# Altium schematic sheet 8051红外遥控控制电路.SCHDOC
size A4
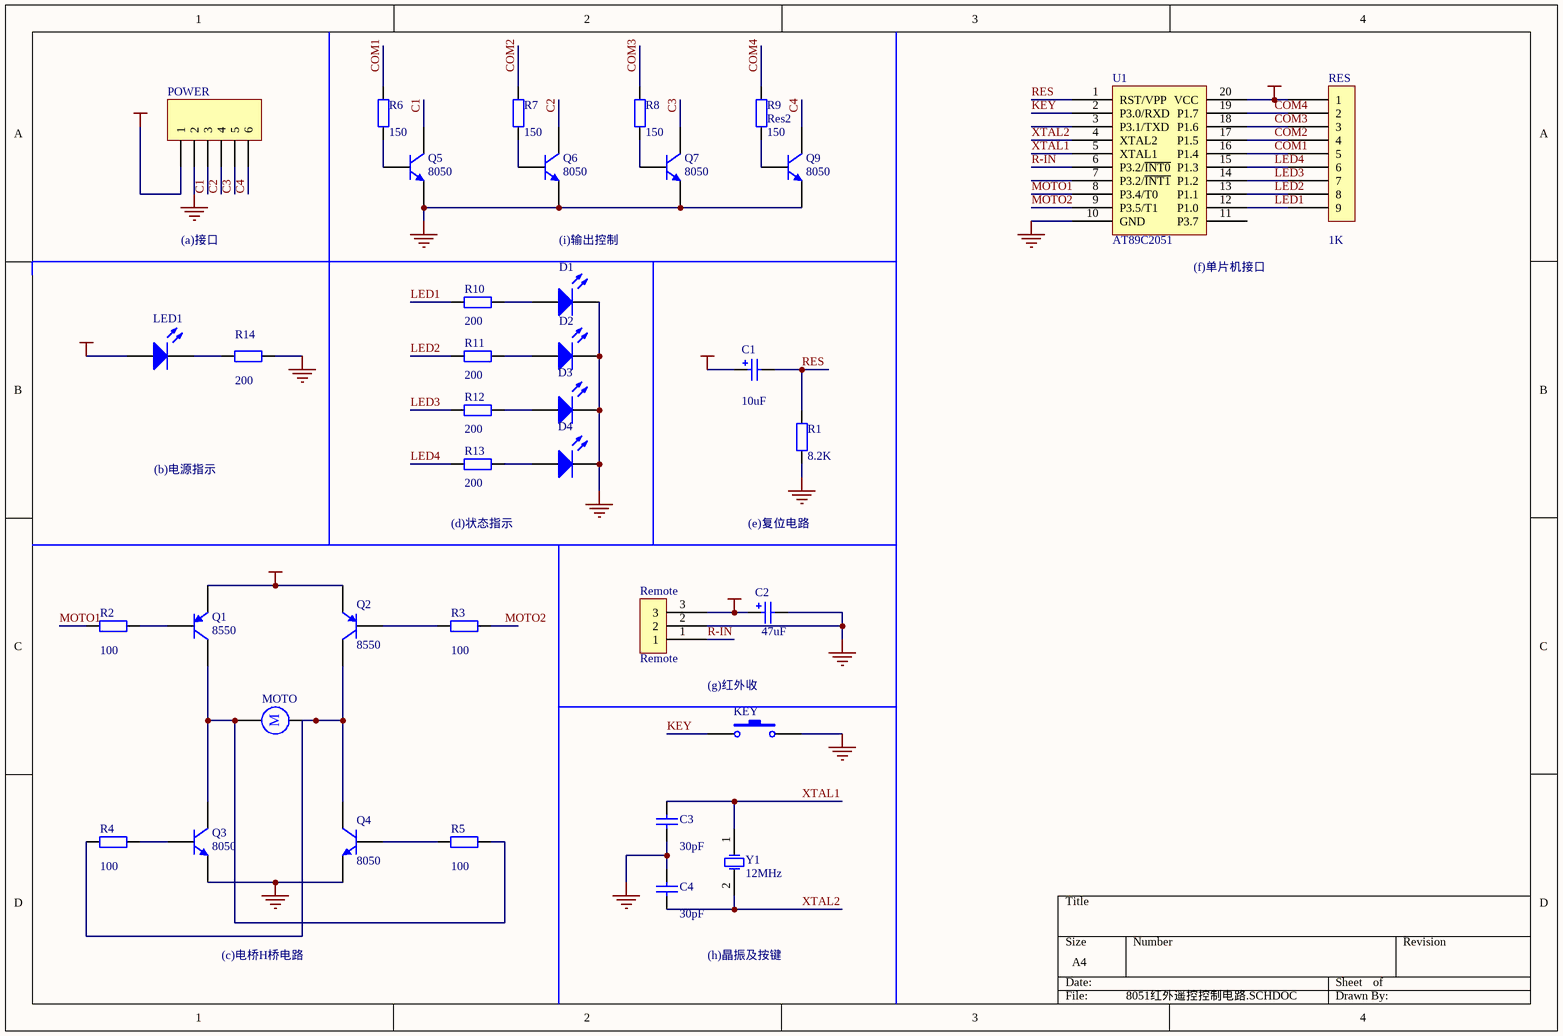
[diagram p0: 8051红外遥控控制电路.SCHDOC]

## Parts
C1  value 10uF  [RB.1/.2]  (hidden comment: Cap Pol2)
C2  value 47uF  [RB.1/.2]  (hidden comment: Cap Pol2)
C3  value 30pF  [RAD-0.1]  (hidden comment: Cap)
C4  value 30pF  [RAD-0.1]  (hidden comment: Cap)
D1  LED2  [LED5]  (value not drawn)
D2  LED2  [LED5]  (value not drawn)
D3  LED2  [LED5]  (value not drawn)
D4  LED2  [LED5]  (value not drawn)
KEY  SW-PB  [SW_PB]  (value not drawn)
LED1  LED0  [LED5]  (value not drawn)
MOTO  Motor  [AXIAL-0.3]  (value not drawn)
POWER  Header 6  [HDR1X6]  (value not drawn)
Q1  8550  [SO-G3/C2.5]
Q2  8550  [SO-G3/C2.5]
Q3  8050  [BCY-W3]
Q4  8050  [BCY-W3]
Q5  8050  [BCY-W3/E4]
Q6  8050  [BCY-W3/E4]
Q7  8050  [BCY-W3/E4]
Q9  8050  [BCY-W3/E4]
R1  value 8.2K  [AXIAL-0.4]  (hidden comment: Res2)
R2  value 100  [AXIAL-0.4]  (hidden comment: Res2)
R3  value 100  [AXIAL-0.4]  (hidden comment: Res2)
R4  value 100  [AXIAL-0.4]  (hidden comment: Res2)
R5  value 100  [AXIAL-0.4]  (hidden comment: Res2)
R6  value 150  [AXIAL-0.4]  (hidden comment: Res2)
R7  value 150  [AXIAL-0.4]  (hidden comment: Res2)
R8  value 150  [AXIAL-0.4]  (hidden comment: Res2)
R9  Res2  value 150  [AXIAL-0.4]
R10  value 200  [AXIAL-0.4]  (hidden comment: Res2)
R11  value 200  [AXIAL-0.4]  (hidden comment: Res2)
R12  value 200  [AXIAL-0.4]  (hidden comment: Res2)
R13  value 200  [AXIAL-0.4]  (hidden comment: Res2)
R14  value 200  [AXIAL-0.4]  (hidden comment: Res2)
Remote  Remote  [REM]
RES  value 1K  [SIP9]  (hidden comment: RES)
U1  AT89C2051  [DIP20]
Y1  12MHz  [BCY-W2/D3.1]

## Nets
GND: C2.2 C3.1 C4.2 D1.2(K) D2.2(K) D3.2(K) D4.2(K) KEY.2 POWER.2 Q3.3(E) Q4.3(E) Q5.1(E) Q6.1(E) Q7.1(E) Q9.1(E) R1.1 R14.2 Remote.2 U1.10(GND)
VCC: C1.1 C2.1 LED1.1(A) POWER.1 Q1.3(E) Q2.3(E) Remote.3 RES.1 U1.20(VCC)
C1: POWER.3 Q5.3(C)
C2: POWER.4 Q6.3(C)
C3: POWER.5 Q7.3(C)
C4: POWER.6 Q9.3(C)
COM1: R6.2 RES.5 U1.16(P1.4)
COM2: R7.2 RES.4 U1.17(P1.5)
COM3: R8.2 RES.3 U1.18(P1.6)
COM4: R9.2 RES.2 U1.19(P1.7)
KEY: KEY.1 U1.2(P3.0/RXD)
LED1: R10.1 RES.9 U1.12(P1.0)
LED2: R11.1 RES.8 U1.13(P1.1)
LED3: R12.1 RES.7 U1.14(P1.2)
LED4: R13.1 RES.6 U1.15(P1.3)
MOTO1: R2.1 U1.8(P3.4/T0)
MOTO2: R3.2 U1.9(P3.5/T1)
R-IN: Remote.1 U1.6(P3.2/~{INT0})
RES: C1.2 R1.2 U1.1(RST/VPP)
XTAL1: C3.2 U1.5(XTAL1) Y1.1(OSC1)
XTAL2: C4.1 U1.4(XTAL2) Y1.2(OSC2)
NetD1_1: D1.1(A) R10.2
NetD2_1: D2.1(A) R11.2
NetD3_1: D3.1(A) R12.2
NetD4_1: D4.1(A) R13.2
NetLED1_2: LED1.2(K) R14.1
NetMOTO_1: MOTO.1 Q1.1(C) Q3.1(C) R5.2
NetMOTO_2: MOTO.2 Q2.1(C) Q4.1(C) R4.1
NetQ1_2: Q1.2(B) R2.2
NetQ2_2: Q2.2(B) R3.1
NetQ3_2: Q3.2(B) R4.2
NetQ4_2: Q4.2(B) R5.1
NetQ5_2: Q5.2(B) R6.1
NetQ6_2: Q6.2(B) R7.1
NetQ7_2: Q7.2(B) R8.1
NetQ9_2: Q9.2(B) R9.1

Not connected (* = marked no-connect by the designer): U1 3(P3.1/TXD) 7(P3.2/~{INT1}) 11(P3.7)

## Notes on the sheet
- (a)接口
- (i)输出控制
- (near U1) (f)单片机接口
- (b)电源指示
- (d)状态指示
- (e)复位电路
- (g)红外收
- (c)电桥H桥电路
- (h)晶振及按键
- (in symbol Motor) M

## Library data of the parts
C1 C2 = Cap Pol2: Polarized Capacitor (Axial); Published: 8-Jun-2000; LatestRevisionDate: 17-Jul-2002; LatestRevisionNote: Re-released for DXP Platform.; Publisher: Altium Limited
C3 C4 = Cap: Capacitor; Published: 8-Jun-2000; LatestRevisionDate: 17-Jul-2002; LatestRevisionNote: Re-released for DXP Platform.; Publisher: Altium Limited
D1-D4 = LED2: Typical RED, GREEN, YELLOW, AMBER GaAs LED; Published: 8-Jun-2000; LatestRevisionDate: 17-Jul-2002; LatestRevisionNote: Re-released for DXP Platform.; Publisher: Altium Limited
KEY = SW-PB: Switch; Published: 24-Mar-1999; LatestRevisionDate: 17-Jul-2002; LatestRevisionNote: Re-released for DXP Platform.; Publisher: Altium Limited
LED1 = LED0: Typical INFRARED GaAs LED; Published: 8-Jun-2000; LatestRevisionDate: 17-Jul-2002; LatestRevisionNote: Re-released for DXP Platform.; Publisher: Altium Limited
MOTO = Motor: Motor, General Kind; Published: 24-Mar-1999; LatestRevisionDate: 17-Jul-2002; LatestRevisionNote: Re-released for DXP Platform.; Publisher: Altium Limited
POWER = Header 6: Header, 6-Pin; LatestRevisionDate: 17-Jul-2002; LatestRevisionNote: Re-released for DXP Platform.; Publisher: Altium Limited
Q1 Q2 = PNP: PNP Bipolar Transistor; Published: 8-Jun-2000; LatestRevisionDate: 17-Jul-2002; LatestRevisionNote: Re-released for DXP Platform.; Publisher: Altium Limited; Code_JEDEC: SOT-23
Q3 Q4 = NPN: NPN Bipolar Transistor; Published: 8-Jun-2000; LatestRevisionDate: 17-Jul-2002; LatestRevisionNote: Re-released for DXP Platform.; Publisher: Altium Limited; Code_JEDEC: TO-226-AA
Q5-Q7 Q9 = 2N3904: NPN General Purpose Amplifier; Published: 8-Jun-2000; LatestRevisionDate: 15-Jan-2003; LatestRevisionNote: PCB Footprint 'BCY-W3/D4.7' replaced; DatasheetDocument: 1997; PackageReference: TO-92A; Publisher: Altium Limited; Code_JEDEC: TO-92A
R1-R14 = Res2: Resistor; Published: 8-Jun-2000; LatestRevisionDate: 17-Jul-2002; LatestRevisionNote: Re-released for DXP Platform.; Publisher: Altium Limited
Y1 = XTAL: Crystal Oscillator; Published: 8-Jun-2000; LatestRevisionDate: 17-Jul-2002; LatestRevisionNote: Re-released for DXP Platform.; Publisher: Altium Limited